# EasyEDA Pro project ProPrj_小船 (1)_2025-03-03.epro

# Schematic 驱动板原理图_1
Board Name: 遥控小船驱动板_1; Create Date: 2023-03-11; Page Name: P1; Project Name: 小船 (1); Schematic Name: 驱动板原理图_1; Update Date: 2025-02-25; Company: 嘉立创EDA; Page Size: A3; Version: V1.0
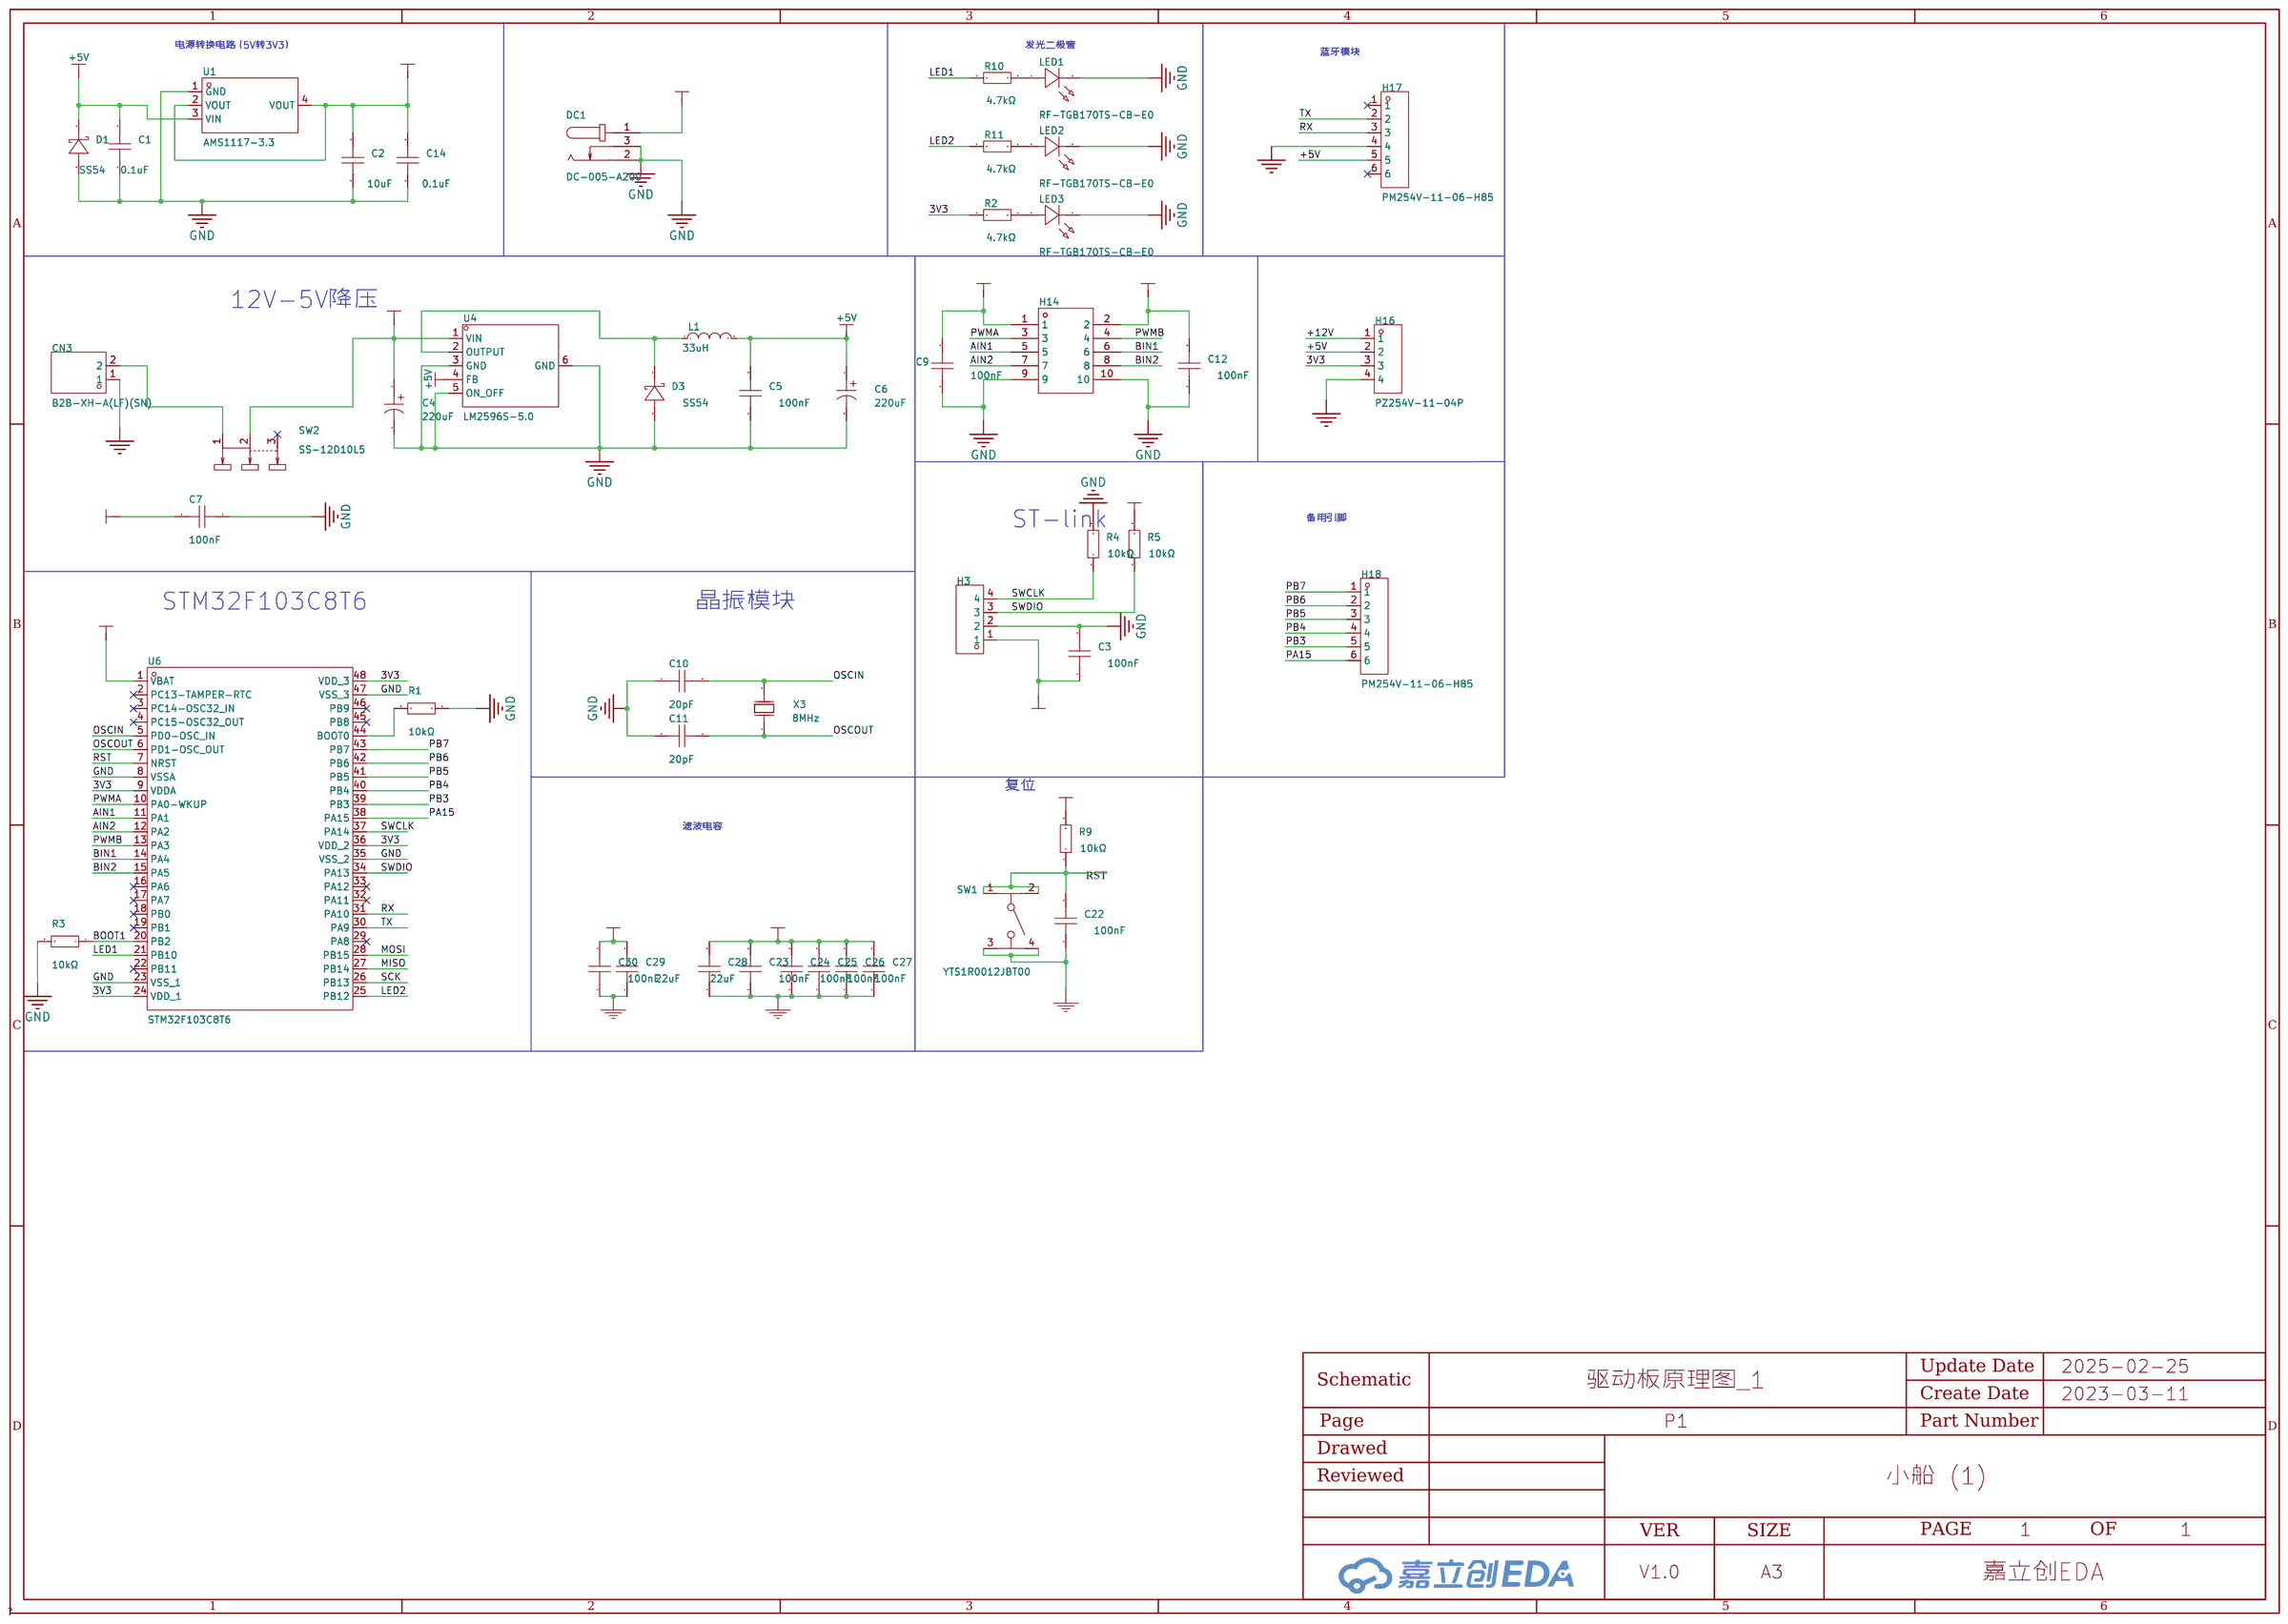
[diagram p0: schematic sheet]

## Parts
C1  0.1uF  [C0805]
C2  10uF  [C0805]
C3  100nF  [C0805]
C4  220uF  [CAP-SMD_BD6.3-L6.6-W6.6-FD]
C5  100nF  [C0805]
C6  220uF  [CAP-SMD_BD6.3-L6.6-W6.6-FD]
C7  100nF  [C0805]
C9  100nF  [C0805]
C10  20pF  [C0805]
C11  20pF  [C0805]
C12  100nF  [C0805]
C14  0.1uF  [C0805]
C22  100nF  [C0805]
C23  100nF  [C0805]
C24  100nF  [C0805]
C25  100nF  [C0805]
C26  100nF  [C0805]
C27  100nF  [C0805]
C28  22uF  [C0805]
C29  22uF  [C0805]
C30  100nF  [C0805]
CN3  B2B-XH-A(LF)(SN)  [CONN-TH_B2B-XH-A-LF-SN]
D1  SS54  [SMA_L4.3-W2.6-LS5.0-RD]
D3  SS54  [SMA_L4.3-W2.6-LS5.0-RD]
DC1  DC-005-A200  [DC-IN-TH_DC-005-A200]
H3  -  [HDR-TH_4P-P2.54-V-M]
H14  -  [HDR-TH_10P-P2.54-V-M-R2-C5-S2.54]
H16  PZ254V-11-04P  [HDR-TH_4P-P2.54-V-M]
H17  PM254V-11-06-H85  [HDR-TH_6P-P2.54-V-F]
H18  PM254V-11-06-H85  [HDR-TH_6P-P2.54-V-F]
L1  33uH  [IND-SMD_L7.5-W7.5_CYH74]
LED1  RF-TGB170TS-CB-E0  [LED0805-R-RD]
LED2  RF-TGB170TS-CB-E0  [LED0805-R-RD]
LED3  RF-TGB170TS-CB-E0  [LED0805-R-RD]
R1  10kΩ  [C0805]
R2  4.7kΩ  [R0805]
R3  10kΩ  [C0805]
R4  10kΩ  [R0805]
R5  10kΩ  [R0805]
R9  10kΩ  [R0805]
R10  4.7kΩ  [R0805]
R11  4.7kΩ  [R0805]
SW1  YTS1R0012JBT00  [SW-TH_4P-L6.0-W6.0-P4.50-LS6.5]
SW2  SS-12D10L5  [SW-TH_SS-12D10L5]
U1  AMS1117-3.3  [SOT-223-3_L6.5-W3.4-P2.30-LS7.0-BR]
U4  LM2596S-5.0  [TO-263-5_L10.1-W8.7-P1.70-LS14.4-BR]
U6  STM32F103C8T6  [LQFP-48_L7.0-W7.0-P0.50-LS9.0-BL]
X3  8MHz  [HC-49US_L11.0-W4.6-P4.88]

## Library data of the parts
C1 C14 = GRM31CR61C476ME44L: 容值:47uF;精度:±20%;额定电压:16V;材质(温度系数):X5R;; LCSC Part Name: 47uF ±20% 16V; Supplier Part: C385047; Manufacturer: muRata(村田); Supplier Footprint: 1206; JLCPCB Part Class: 扩展库; Datasheet: https://atta.szlcsc.com/upload/public/pdf/source/20190520/C385047_976DAB2B198F62C3FC0888BB9E7F2E96.pdf; Supplier: LCSC; Tolerance: ±20%; Voltage Rated: 16V; Temperature Coefficient: X5R
C2 C5 C7 C9 C12 = C0805X104K101T: 温度系数:X7R;容值:100nF;精度:±10%;额定电压:100V;; LCSC Part Name: 100nF(104) ±10% 100V; Supplier Part: C485772; Manufacturer: IHHEC(禾伸堂); Supplier Footprint: 0805; JLCPCB Part Class: 扩展库; Datasheet: https://atta.szlcsc.com/upload/public/pdf/source/20200117/C485772_1C2A03D89DC7D3F931FB9AFBA2903E68.pdf; Supplier: LCSC; Temperature Coefficient: X7R; Tolerance: ±10%; Voltage Rated: 100V
C3 C22-C27 C30 = 0603F104Z500CT_C83060: 容值:100nF;精度:-20%~+80%;额定电压:50V;材质(温度系数):Y5V;; LCSC Part Name: 100nF -20%~+80% 50V; Supplier Part: C83060; Manufacturer: Walsin(华新科); Manufacturer Part: 0603F104Z500CT; Supplier Footprint: 0603; JLCPCB Part Class: 扩展库; Datasheet: https://atta.szlcsc.com/upload/public/pdf/source/20161119/1479540179445.pdf; Supplier: LCSC; Tolerance: -20%~+80%; Voltage Rated: 50V; Temperature Coefficient: Y5V
C4 C6 = RX220UF25V90RV0108: 容值:220uF;额定电压:25V;; LCSC Part Name: 220uF 25V; Supplier Part: C3445241; Manufacturer: KNSCHA(科尼盛); Supplier Footprint: SMD,D6.3xL7.7mm; JLCPCB Part Class: 扩展库; Datasheet: https://atta.szlcsc.com/upload/public/pdf/source/20220701/BB366CEC186885B1D373A78C7532E1E0.pdf; Supplier: LCSC; Rated Voltage: 25V
C10 C11 = 0603CG200J101NT: 容值:20pF;精度:±5%;额定电压:100V;材质(温度系数):C0G;额定电压(VAC):-;; LCSC Part Name: 20pF ±5% 100V; Supplier Part: C2762329; Manufacturer: FH(风华); Supplier Footprint: 0603; JLCPCB Part Class: 扩展库; Datasheet: https://atta.szlcsc.com/upload/public/pdf/source/20211026/1B9CC6FF40D574A190437DF0D5F8F6A6.pdf; Supplier: LCSC; Tolerance: ±5%; Voltage Rated: 100V; Temperature Coefficient: C0G
C28 C29 = CL10A226MR8NQNC: 容值:22uF;精度:±20%;额定电压:4V;材质(温度系数):X5R;; LCSC Part Name: 22uF ±20% 4V; Supplier Part: C478860; Manufacturer: SAMSUNG(三星); Supplier Footprint: 0603; JLCPCB Part Class: 扩展库; Datasheet: https://atta.szlcsc.com/upload/public/pdf/source/20200102/C478860_118E1D8359E9872D4918B647A961198D.pdf; Supplier: LCSC; Tolerance: ±20%; Voltage Rated: 4V; Temperature Coefficient: X5R
CN3 = B2B-XH-A(LF)(SN): 插针结构:1x2P;间距:2.5mm;安装方式:直插;参考系列:XH;总PIN数:2P;排数:1;每排PIN数:2;行距:-;额定电流:3A;触头材质:黄铜;触头镀层:锡;工作温度范围:-25℃~+85℃;; LCSC Part Name: 1x2P 间距:2.5mm 直插 系列:XH; Supplier Part: C158012; Manufacturer: JST; Supplier Footprint: 插件,P=2.5mm; JLCPCB Part Class: 扩展库; Datasheet: https://atta.szlcsc.com/upload/public/pdf/source/20180928/C265283_F9DFEEBDB2CF642B6BDFAB4B77BD2680.pdf; Supplier: LCSC; Pins Structure: 1x2P; Pitch: 2.5mm; Mounting Style: 直插; Reference Series: XH; Number of Pins: 2P; Number of Rows: 1; Number of PINs Per Row: 2; Current Rating (Max): 3A; Contact Material: 黄铜; Contact Plating: 锡; Operating Temperature Range: -25℃~+85℃; Rated Voltage (Max): 250V; Plastic Material: PA66; Flame Retardant Rating: UL94V-0; Supplementary Features: 打K脚; Colour: 白色; Z-Height of the Board: 7mm; X-Length of Bottom Edge on Board (Spacing Line): 7.4mm; Y-Width of Bottom Edge on Board: 5.75mm
D1 D3 = SS54_C727065: Supplier Part: C727065; Manufacturer: TWGMC(台湾迪嘉); Supplier Footprint: SMA; JLCPCB Part Class: 扩展库; Datasheet: https://atta.szlcsc.com/upload/public/pdf/source/20200828/C727064_BD0A2B36CBC76CEA4B6710C57718D41F.pdf; Supplier: LCSC
DC1 = DC-005-A200: 连接器类型:DC电源插座;安装方式:弯插;触点内径:2mm;触点外径:6.4mm;额定电流:3A;额定电压:30V;工作温度范围:-20℃~+70℃;; LCSC Part Name: DC电源插座 内径:2mm 外径:6.4mm; Supplier Part: C720557; Manufacturer: XUNPU(讯普); Supplier Footprint: 插件; JLCPCB Part Class: 扩展库; Datasheet: https://atta.szlcsc.com/upload/public/pdf/source/20200812/C720557_2286DFCD6C75B71AF905731F627ABF3A.pdf; Supplier: LCSC; Connector Type: DC电源插座; Mounting Style: 弯插; Inside Contact Diameter: 2mm; Outside Contact Diameter: 6.4mm; Current Rating (Max): 3A; Voltage Rating (Max): 30V; Operating Temperature Range: -20℃~+70℃
H3 = HDR-M_2.54_1x4P: Supplier Part: C492403; Supplier Footprint: 插件
H14 = HDR-M_2.54_2x5: Supplier Part: C124387; Supplier Footprint: 插件,P=2.54mm
H16 = PZ254V-11-04P: 插针结构:1x4P;间距:2.54mm;行距:-;圆针/方针:方针;安装类型:直插;排数:单排;总PIN位数:4P;额定电流:3A;额定电压:250V;配合针长度:6mm;塑高:2.5mm;端接针长度:3mm;触头材质:-;工作温度范围:-40℃~+105℃;颜色:黑色;; LCSC Part Name: 间距:2.54mm 1x4P 直插 方针; Supplier Part: C2691448; Manufacturer: XFCN(兴飞); Supplier Footprint: 插件,P=2.54mm; JLCPCB Part Class: 扩展库; Datasheet: https://atta.szlcsc.com/upload/public/pdf/source/20200309/C492403_F9F19131791D08044AD4F84F8E751A34.pdf; Supplier: LCSC; Pin Structure: 1x4P; Pitch: 2.54mm; Circluar Pins/Square Pins: 方针; Mounting Type: 直插; Number of Rows: 单排; Number of Pins: 4P; Current Rating (Max): 3A; Voltage Rating (Max): 250V; Length of Mating Pin: 6mm; Insulation Height: 2.5mm; Length of End Connection Pin: 3mm; Operating Temperature Range: -40℃~+105℃; Color: 黑色
H17 H18 = PM254V-11-06-H85: 插孔结构:1x6P;间距:2.54mm;行距:-;圆孔/方孔:方孔;安装类型:直插;排数:单排;总孔位数:6P;额定电流:3A;额定电压:250V;插孔方向:顶部;塑高:-;工作温度范围:-40℃~+105℃;; LCSC Part Name: 间距:2.54mm 1x6P 直插; Supplier Part: C2832269; Manufacturer: XFCN(兴飞); Supplier Footprint: 插件,P=2.54mm; JLCPCB Part Class: 扩展库; Datasheet: https://atta.szlcsc.com/upload/public/pdf/source/20210514/C2832269_B3EC97736B37C2783BDCE3050AA57447.pdf; Supplier: LCSC; Holes Structure: 1x6P; Pitch: 2.54mm; Circular Hole / Square Hole: 方孔; Mounting Type: 直插; Number of Rows: 单排; Number of Holes: 6P; Current Rating (Max): 3A; Voltage Rating (Max): 250V; Holes Direction: 顶部; Operating Temperature Range: -40℃~+105℃
L1 = CYH74-33UH: 电感值:33uH;精度:±20%;额定电流:-;饱和电流(Isat):-;直流电阻(DCR):-;类型:-;; LCSC Part Name: 33uH ±20%; Supplier Part: C2879696; Manufacturer: SHOU HAN(首韩); Supplier Footprint: SMD,7.5x7.5x4.5mm; JLCPCB Part Class: 扩展库; Datasheet: https://atta.szlcsc.com/upload/public/pdf/source/20210813/91E1001E07795DE2AA14A81FBCD1BD6C.pdf; Supplier: LCSC; Tolerance: ±20%
LED1-LED3 = RF-TGB170TS-CB-E0: 发光颜色:翠绿;二极管配置:-;透镜颜色:-;主波长:-;峰值波长:-;色温:-;测试电流:20mA;功率:105mW;发光角度:140°;安装方式:正贴;工作温度:-40℃~+85℃;; LCSC Part Name: 翠绿 正贴; Supplier Part: C2908308; Manufacturer: Refond(瑞丰); Supplier Footprint: 0805; Datasheet: https://atta.szlcsc.com/upload/public/pdf/source/20211101/74947808C66CFB6931D7015E0B9B474F.pdf; Supplier: LCSC; Emitted Color: 翠绿; Forward Current: 20mA; Power Dissipation: 105mW; Viewing Angle: 140°; Mounting Sytle: 正贴; Operating Temperature: -40℃~+85℃
R1 R3 = CR-03FA7---10K: 精度:±1%;阻值:10kΩ;功率:1/10W;电阻类型:厚膜电阻;最大工作电压:75V;工作温度范围:-55℃~+155℃;; LCSC Part Name: 10kΩ ±1%; Supplier Part: C285206; Manufacturer: Viking(光颉); Supplier Footprint: 0603; JLCPCB Part Class: 扩展库; Datasheet: https://atta.szlcsc.com/upload/public/pdf/source/20200107/C285206_266B27C2F3E18A9FD3973E55C7F97F41.pdf; Supplier: LCSC; Tolerance: ±1%; Power(Watts): 1/10W; Type: 厚膜电阻; Overload Voltage (Max): 75V; Operating Temperature Range: -55℃~+155℃
R2 R10 R11 = RMC08054.7K1%N: 阻值:4.7kΩ;精度:±1%;功率:125mW;; LCSC Part Name: 4.7kΩ ±1% 125mW; Supplier Part: C269746; Manufacturer: Tyohm(幸亚电阻); Supplier Footprint: 0805; JLCPCB Part Class: 扩展库; Datasheet: https://atta.szlcsc.com/upload/public/pdf/source/20190115/C269746_3EA3C7E4490C68712FA44CA03852E2BD.pdf; Supplier: LCSC; Tolerance: ±1%; Power(Watts): 125mW
R4 R5 R9 = RC0805DR-0710KL: 电阻类型:厚膜电阻;阻值:10kΩ;精度:±0.5%;功率:125mW;温度系数:±100ppm/℃;最大工作电压:150V;工作温度范围:-55℃~+155℃;; LCSC Part Name: 10kΩ ±0.5% 125mW; Supplier Part: C163503; Manufacturer: YAGEO(国巨); Supplier Footprint: 0805; JLCPCB Part Class: 扩展库; Datasheet: https://atta.szlcsc.com/upload/public/pdf/source/20171228/C163503_15144412299811213806.pdf; Supplier: LCSC; Type: 厚膜电阻; Tolerance: ±0.5%; Power(Watts): 125mW; Temperature Coefficient: ±100ppm/℃; Overload Voltage (Max): 150V; Operating Temperature Range: -55℃~+155℃
SW1 = YTS1R0012JBT00: LCSC Part Name: 轻触开关6x6x8.5 250gf按键插脚; Supplier Part: C5274849; Manufacturer: YIYUAN(怡远); Supplier Footprint: 插件,6x6mm; Datasheet: https://atta.szlcsc.com/upload/public/pdf/source/20220421/61F3B92F713CB3CB2E64126F4B7263E8.pdf; Supplier: LCSC
SW2 = SS-12D10L5: 电路结构:单刀双掷;安装方式:直插;开关颜色:黑色;额定电流(DC):3A;额定电压(DC):125V;额定电流(AC):3A;额定电压(AC):125V;机械寿命:1万次;; LCSC Part Name: 柄长5mm 直插双档 滑动开关; Supplier Part: C319012; Manufacturer: XKB Connectivity(中国星坤); Supplier Footprint: 插件; JLCPCB Part Class: 扩展库; Datasheet: https://atta.szlcsc.com/upload/public/pdf/source/20211009/D6412F37AABE6F9459A6EE7FA4DAEADB.pdf; Supplier: LCSC; Circuit: 单刀双掷; Actuator Style: 矩形柱状; Pin Style: PC引脚; Switch Length: 13mm; Switch Width: 6.8mm; Switch Height: 6.4mm; Mounting Style: 直插; Actuator Color: 黑色; Current Rating (DC): 3A; Voltage Rating (DC): 125V; Current Rating (AC): 3A; Voltage Rating (AC): 125V; Mechanical Life: 1万次; Operating Temperature: -40℃~+85℃
U1 = AMS1117-3.3_C6186: 输出类型:固定;输出极性:正;输出通道数:1;最大输入电压:-;输出电压:3.3V;压差:1.3V@(800mA);静态电流(地电流):-;输出电流:1A;电源纹波抑制比(PSRR):72dB@(120Hz);噪声:-;特性:-;工作温度:-;; LCSC Part Name: Vout=3.3V 1A 72dB@(120Hz); Supplier Part: C6186; Manufacturer: 美国AMS; Supplier Footprint: SOT-223; JLCPCB Part Class: 基础库; Datasheet: https://atta.szlcsc.com/upload/public/pdf/source/20180727/C6186_7A095716F0823C02F1997A905E26C086.pdf; Supplier: LCSC; Output Type: 固定; Output Polarity: 正; Number of Outputs: 1; Output Voltage: 3.3V; Dropout Voltage: 1.3V@(800mA); Output Current: 1A; Power Supply Rejection Ratio (PSRR): 72dB@(120Hz)
U4 = LM2596S-5.0: Supplier Part: C2980820; Manufacturer: Slkor(萨科微); Supplier Footprint: TO-263-5; JLCPCB Part Class: 扩展库; Datasheet: https://atta.szlcsc.com/upload/public/pdf/source/20220307/173BE2986C0475AA3DE2BE519613A176.pdf; Supplier: LCSC
U6 = STM32F103C8T6: CPU内核:ARM Cortex-M3;CPU最大主频:72MHz;工作电压范围:2V~3.6V;内部振荡器:有;程序 FLASH容量:64K@x8bit;RAM总容量:20KB;EEPROM/数据 FLASH容量:-;GPIO端口数量:37;ADC(单元数/通道数/位数):1@x10ch/12bit;外设/功能/协议栈:温度传感器；DMA；看门狗；POR；PWM;工作温度范围:-40℃~+85℃;; LCSC Part Name: ARM Cortex-M3 72MHz 64K@x8bit 20KB MSL=3; Supplier Part: C8734; Manufacturer: ST(意法半导体); Supplier Footprint: LQFP-48_7x7x05P; JLCPCB Part Class: 基础库; Datasheet: https://atta.szlcsc.com/upload/public/pdf/source/20140724/1457707174202.pdf; Supplier: LCSC; CPU Core: ARM Cortex-M3; Maximum Frequency: 72MHz; Supply Voltage Range: 2V~3.6V; Internal Oscillator: 有; Program FLASH Size: 64K@x8bit; RAM Size: 20KB; GPIO Ports Number: 37; ADC (Units/Channels/bits): 1@x10ch/12bit; Peripherals / Functions / Protocol Stacks: 温度传感器；DMA；看门狗；POR；PWM; Operating Temperature Range: -40℃~+85℃
X3 = 49SAC08000182060: 晶振类型:49S晶振;频率:8MHz;频率公差:±20ppm;频率稳定度:±30ppm;负载电容:18pF;等效串联电阻(ESR):60Ω;工作温度:-40℃~+85℃;; LCSC Part Name: 8MHz ±20ppm 18pF; Supplier Part: C390747; Manufacturer: JGHC(晶光华); Supplier Footprint: HC-49S-2P; JLCPCB Part Class: 扩展库; Datasheet: https://atta.szlcsc.com/upload/public/pdf/source/20191012/C390747_81316E4F70B570C645DE19ECCB729A4F.pdf; Supplier: LCSC; Crystal Type: 49S晶振; Frequency Tolerance: ±20ppm; Frequency Stability: ±30ppm; Load Capacitance: 18pF; Equivalent Series Resistance (ESR): 60Ω; Operating Temperature: -40℃~+85℃

## Nets
3V3: C2.2 C3.1 C9.2 C12.2 C14.2 C23.2 C24.2 C25.2 C26.2 C27.2 C28.2 H3.1 H14.1 H14.2 H16.3 R2.1 R5.2 R9.2 U1.2(VOUT) U1.4(VOUT) U6.1(VBAT) U6.9(VDDA) U6.24(VDD_1) U6.36(VDD_2) U6.48(VDD_3)
+5V: C1.2 C5.2 C6.1 C29.2 C30.2 D1.1 H16.2 H17.5 L1.2 U1.3(VIN) U4.4(FB)
+12V: C4.1 C7.2 DC1.1 H16.1 SW2.2 U4.1(VIN)
GND: C1.1 C2.1 C3.2 C4.2 C5.1 C6.2 C7.1 C9.1 C10.1 C11.1 C12.1 C14.1 C22.1 C23.1 C24.1 C25.1 C26.1 C27.1 C28.1 C29.1 C30.1 CN3.1 D1.2 D3.2 DC1.2 DC1.3 H3.2 H14.9 H14.10 H16.4 H17.4 LED1.2 LED2.2 LED3.2 R1.1 R3.2 R4.2 SW1.3 SW1.4 U1.1(GND) U4.3(GND) U4.5(ON_OFF) U4.6(GND) U6.8(VSSA) U6.23(VSS_1) U6.35(VSS_2) U6.47(VSS_3)
AIN1: H14.5 U6.11(PA1)
AIN2: H14.7 U6.12(PA2)
BIN1: H14.6 U6.14(PA4)
BIN2: H14.8 U6.15(PA5)
BOOT1: R3.1 U6.20(PB2)
LED1: R10.1 U6.21(PB10)
LED2: R11.1 U6.25(PB12)
MISO: U6.27(PB14)
MOSI: U6.28(PB15)
OSCIN: C10.2 U6.5(PD0-OSC_IN) X3.2(OSC2)
OSCOUT: C11.2 U6.6(PD1-OSC_OUT) X3.1(OSC1)
PA15: H18.6 U6.38(PA15)
PB3: H18.5 U6.39(PB3)
PB4: H18.4 U6.40(PB4)
PB5: H18.3 U6.41(PB5)
PB6: H18.2 U6.42(PB6)
PB7: H18.1 U6.43(PB7)
PWMA: H14.3 U6.10(PA0-WKUP)
PWMB: H14.4 U6.13(PA3)
RST: C22.2 R9.1 SW1.1 SW1.2 U6.7(NRST)
RX: H17.3 U6.31(PA10)
SCK: U6.26(PB13)
SWCLK: H3.4 R4.1 U6.37(PA14)
SWDIO: H3.3 R5.1 U6.34(PA13)
TX: H17.2 U6.30(PA9)
Net-(CN3-2): CN3.2 SW2.1
Net-(D3-1): D3.1 L1.1 U4.2(OUTPUT)
Net-(LED1-1): LED1.1 R10.2
Net-(LED2-1): LED2.1 R11.2
Net-(LED3-1): LED3.1 R2.2
Net-(R1-2): R1.2 U6.44(BOOT0)

Not connected (* = marked no-connect by the designer): H17 1* 6*; SW2 3*; U6 2(PC13-TAMPER-RTC)* 3(PC14-OSC32_IN)* 4(PC15-OSC32_OUT)* 16(PA6)* 17(PA7)* 18(PB0)* 19(PB1)* 22(PB11)* 29(PA8)* 32(PA11)* 33(PA12)* 45(PB8)* 46(PB9)*

## Notes on the sheet
- 电源转换电路（5V转3V3）
- 发光二极管
- 蓝牙模块
- 12V-5V降压
- ST-link
- 备用引脚
- STM32F103C8T6
- 晶振模块
- 复位
- 滤波电容
